# Altium schematic sheet coil_processing.SchDoc
size A
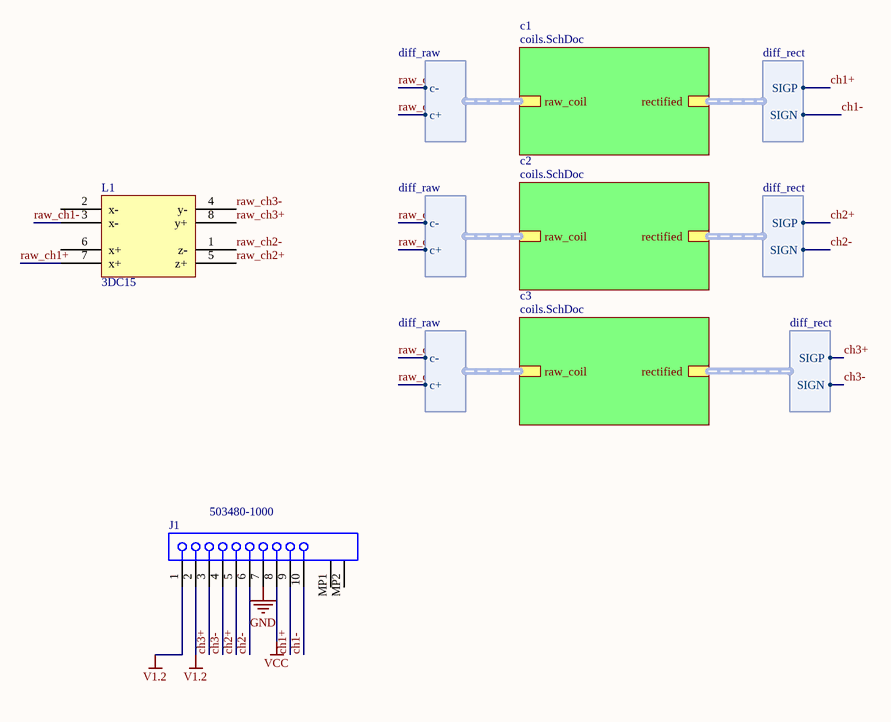
[diagram p0: coil_processing.SchDoc]

## Parts
J1  503480-1000  [MOLX-503480-1000]
L1  3DC15  [3DC15]

## Sub-sheets
c1 = coils.SchDoc: raw_coil (harness diff_raw), rectified (harness diff_rect)
c2 = coils.SchDoc: raw_coil (harness diff_raw), rectified (harness diff_rect)
c3 = coils.SchDoc: raw_coil (harness diff_raw), rectified (harness diff_rect)

## Harnesses
diff_raw: c-, c+
diff_rect: SIGN, SIGP

## Nets
GND: J1.7
V1.2: J1.1 J1.2
VCC: J1.8
ch1+: J1.9 ; sheet c1/rectified.SIGP
ch1-: J1.10 ; sheet c1/rectified.SIGN
ch2+: J1.5 ; sheet c2/rectified.SIGP
ch2-: J1.6 ; sheet c2/rectified.SIGN
ch3+: J1.3 ; sheet c3/rectified.SIGP
ch3-: J1.4 ; sheet c3/rectified.SIGN
raw_ch1+: L1.7(x+) ; sheet c1/raw_coil.c+
raw_ch1-: L1.3(x-) ; sheet c1/raw_coil.c-
raw_ch2+: L1.5(z+) ; sheet c2/raw_coil.c+
raw_ch2-: L1.1(z-) ; sheet c2/raw_coil.c-
raw_ch3+: L1.8(y+) ; sheet c3/raw_coil.c+
raw_ch3-: L1.4(y-) ; sheet c3/raw_coil.c-

Not connected (* = marked no-connect by the designer): J1 MP1 MP2; L1 2(x-) 6(x+)

## Library data of the parts
J1 = CMP-1241-00115-1: 0.5 mm Pitch Easy-On(TM) BackFlip(TM) Type FPC Connector, 1.0 mm Mated Height, Right Angle, SMT, Dual Contact, 10 Circuits, -40 to 85 degC, ELV and RoHS Compliant, Tape and Reel; Manufacturer: Molex; Durability (mating cycles max): 10; Pitch - Mating Interface: 0.50mm; Material - Plating Mating: Gold; Voltage (Max): 50V AC (RMS)/DC; Polarized to PCB: Yes; PCB Locator: No; Current (Max per Contact): 0.5A; Material - Plating Termination: Gold, Tin; Entry Angle: 90degrees Angle; Mated Height: 1.00mm; Material - Metal: Phosphor Bronze; ComponentLink1Description: Manufacturer URL; PartNumber: 503480-1000; Circuits (Loaded): 10; Packing: Tape and Reel; PackageReference: 503480-1000; ComponentLink2URL: http://www.molex.com/webdocs/datasheets/pdf/en-us/5034801000_FFC_FPC_CONNECTORS.pdf; PackageVersion: Rev. F, 09/2012; ComponentLink3Description: Package Specification; ComponentLink3URL: http://www.molex.com/pdm_docs/sd/5034801000_sd.pdf; PackageDescription: 10-Lead FPC Connector, Pitch 0.5 mm; Stackable: No; Mounting Technology: Surface Mount; ComponentLink2Description: Datasheet; PCB Retention: Yes; Number of Rows: 1; Orientation: Right Angle; Contact Position: Dual; RoHS: TRUE; ComponentLink1URL: http://www.molex.com/molex/index.jsp; System: Connector
L1 = 3DV09-A: ComponentLink1Description: Premo; ComponentLink1URL: https://www.grupopremo.com/618-3dcc08-3d-coil-cube-receiver-sensor-for-vr-magnetic-tracking-system-165x148x118-mm-